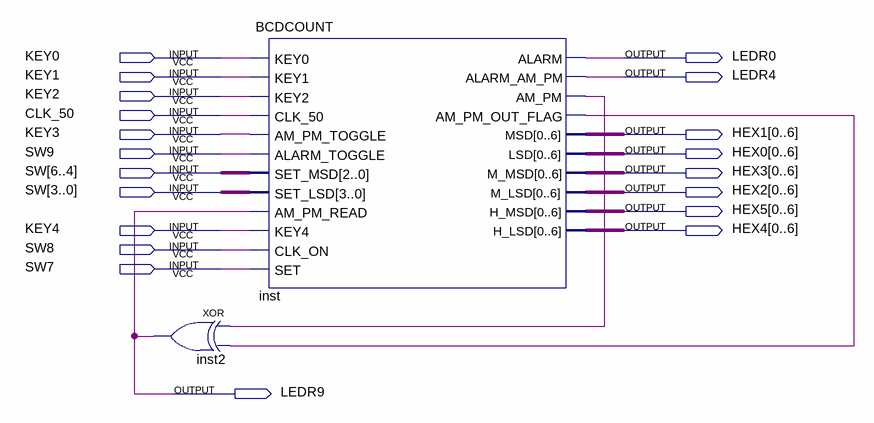
[diagram p0: schematic sheet]
// Quartus schematic block_diag.bdf as structural Verilog: 2 symbols, 20 pins
module block_diag (
  input  KEY0,
  input  KEY1,
  input  KEY2,
  input  CLK_50,
  input  KEY3,
  input  SW9,
  input  [6:0] SW,
  input  KEY4,
  input  SW8,
  input  SW7,
  output LEDR0,
  output LEDR4,
  output [0:6] HEX1,
  output [0:6] HEX0,
  output [0:6] HEX3,
  output [0:6] HEX2,
  output [0:6] HEX5,
  output [0:6] HEX4,
  output LEDR9
);

  wire inst_am_pm, inst_am_pm_out_flag;

  xor inst2 (LEDR9, inst_am_pm, inst_am_pm_out_flag);
  BCDCOUNT inst (
    .KEY0(KEY0), .KEY1(KEY1), .KEY2(KEY2), .CLK_50(CLK_50), .AM_PM_TOGGLE(KEY3), .ALARM_TOGGLE(SW9),
    .SET_MSD(SW[6:4]), .SET_LSD(SW[3:0]), .AM_PM_READ(LEDR9), .KEY4(KEY4), .CLK_ON(SW8), .SET(SW7),
    .ALARM(LEDR0), .ALARM_AM_PM(LEDR4), .AM_PM(inst_am_pm), .AM_PM_OUT_FLAG(inst_am_pm_out_flag), .MSD(HEX1),
    .LSD(HEX0), .M_MSD(HEX3), .M_LSD(HEX2), .H_MSD(HEX5), .H_LSD(HEX4));
endmodule
